# Altium schematic sheet FPGA_52_Keyboard.SchDoc
size B; Organization: Altium Limited; Address1: L3, 12a Rodborough Rd; Address2: Frenchs Forest; Address3: NSW; Address4: Australia 2086; DocumentNumber: 1; SheetNumber: 1; SheetTotal: 1
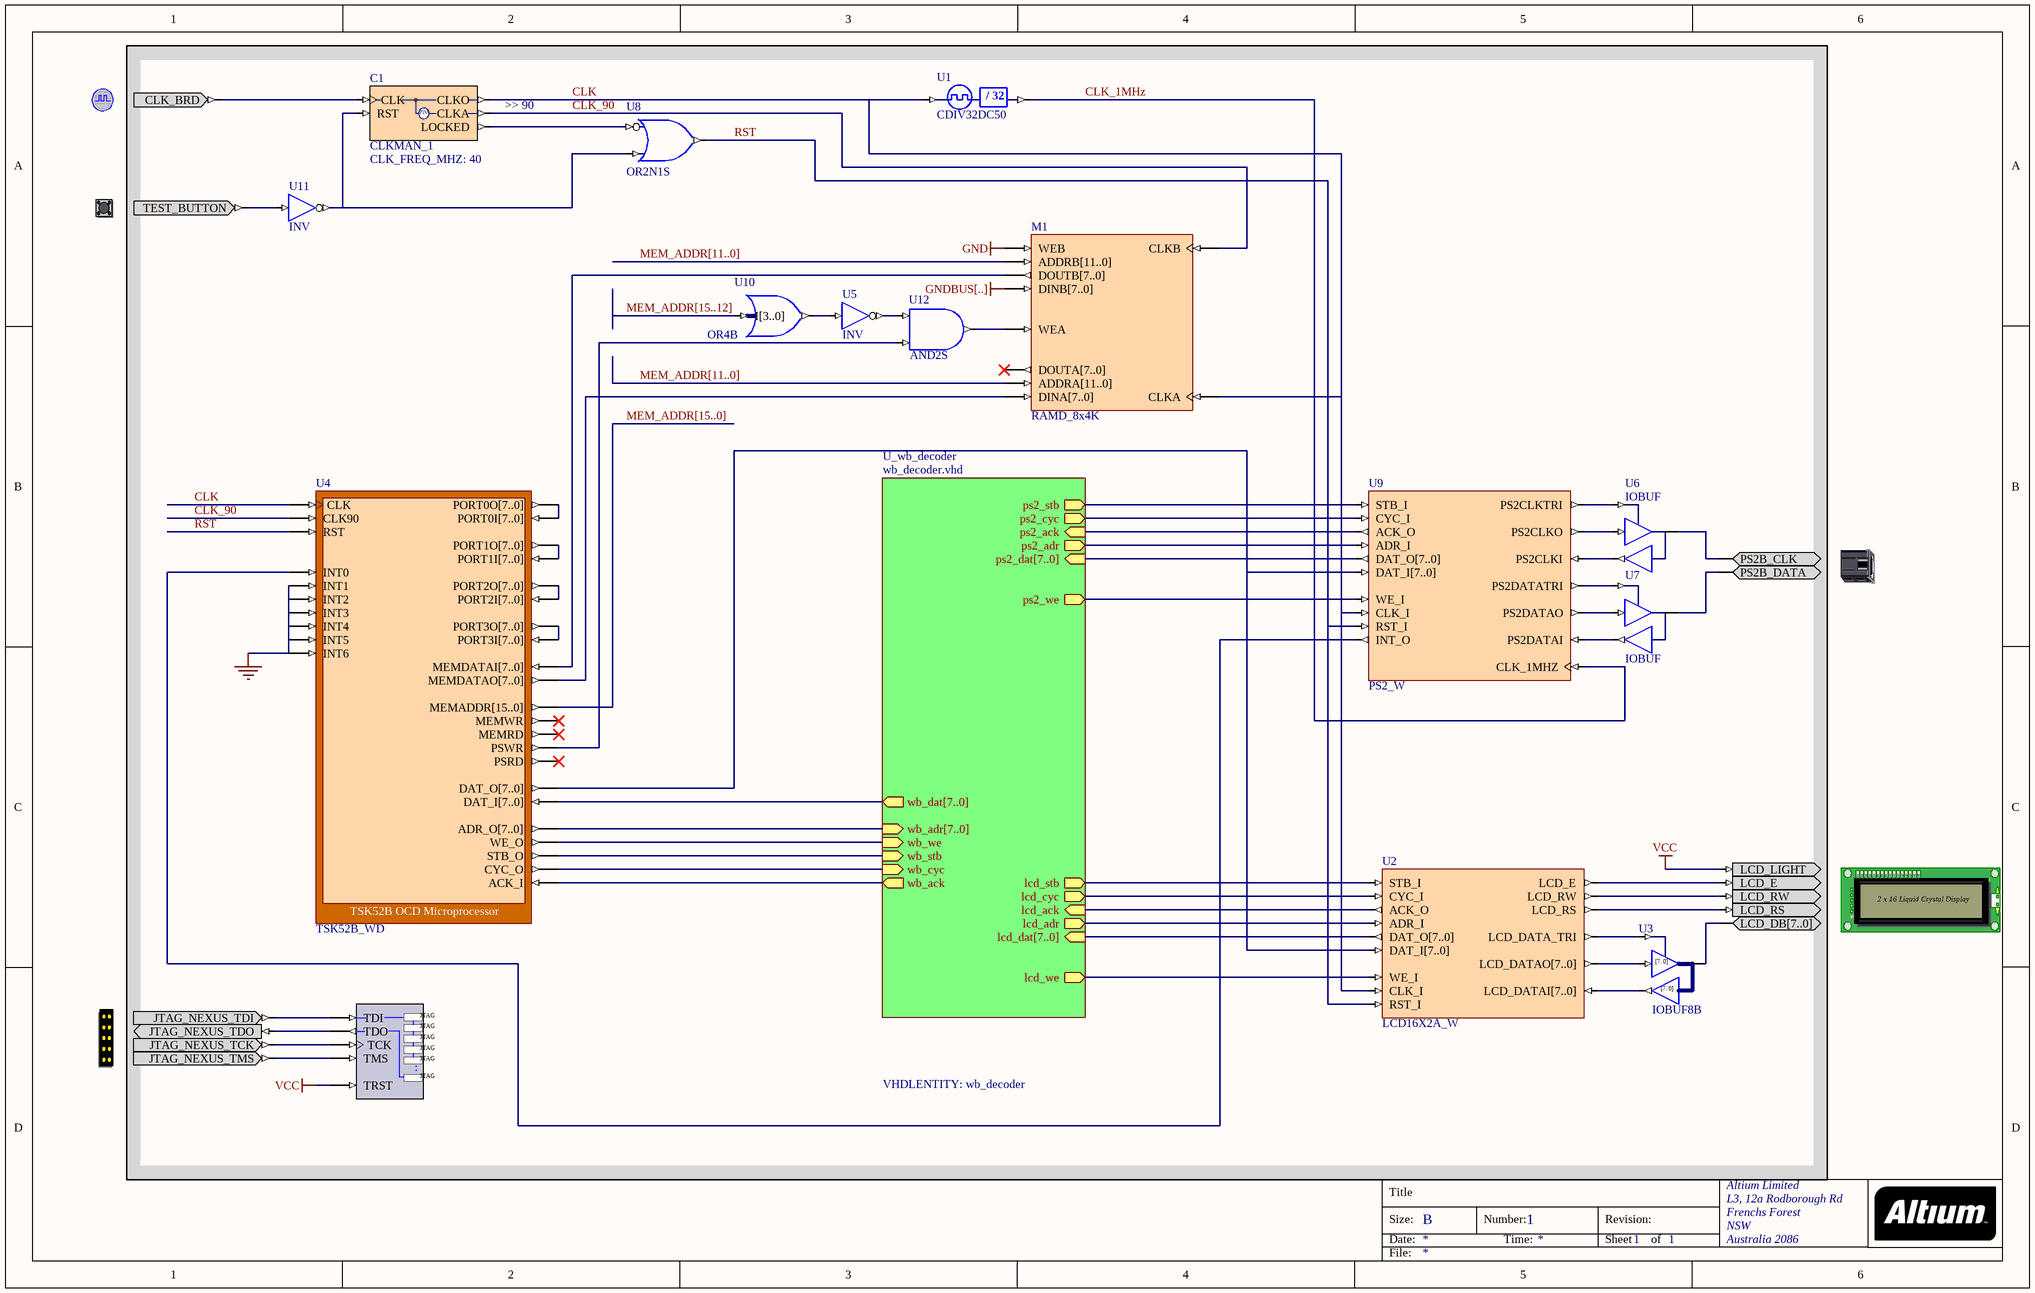
[diagram p0: FPGA_52_Keyboard.SchDoc]

## Parts
(Parts that share a designator on the sheet are numbered #1, #2 ... from top to bottom, then left to right.)
?#1  CLOCK_BOARD  (value not drawn)
?#2  TEST_BUTTON  (value not drawn)
?#3  PS2B  (value not drawn)
?#4  LCD  (value not drawn)
?#5  NEXUS_JTAG_CONNECTOR  (value not drawn)
C1  CLKMAN_1  CLK_FREQ_MHZ: 40  ClkA_Operation: >> 90
M1  RAMD_8x4K
NEXUS_JTAG_PORT  NEXUS_JTAG_PORT  (value not drawn)
U1  CDIV32DC50
U2  LCD16X2A_W
U3  IOBUF8B
U4  TSK52B_WD
U5  INV
U6  IOBUF
U7  IOBUF
U8  OR2N1S
U9  PS2_W
U10  OR4B
U11  INV
U12  AND2S

## Sub-sheets
U_wb_decoder = wb_decoder.vhd: lcd_ack (in), lcd_adr (out), lcd_cyc (out), lcd_dat[7..0] (in), lcd_stb (out), lcd_we (out), wb_ack (out), wb_adr[7..0] (in), wb_cyc (in), wb_dat[7..0] (out), wb_stb (in), wb_we (in), ps2_ack (in), ps2_dat[7..0] (in), ps2_we (out), ps2_stb (out), ps2_cyc (out), ps2_adr (out)  | VHDLENTITY: wb_decoder

## Nets
GND: M1.WEB U4.INT1 U4.INT2 U4.INT3 U4.INT4 U4.INT5 U4.INT6
GNDBUS[..]: M1.DINB[7..0]
VCC: ?#4.LCD_LIGHT NEXUS_JTAG_PORT.TRST
CLK: C1.CLKO M1.CLKA U1.CLKIN U2.CLK_I U4.CLK U9.CLK_I
CLK_1MHz: U1.CLKDV U9.CLK_1MHZ
CLK_90: C1.CLKA M1.CLKB U4.CLK90
MEM_ADDR[11..0]: M1.ADDRA[11..0] M1.ADDRB[11..0]
MEM_ADDR[15..0]: U4.MEMADDR[15..0]
MEM_ADDR[15..12]: U10.I[3..0]
RST: U2.RST_I U4.RST U8.O U9.RST_I
Net?#1_CLK_BRD: ?#1.CLK_BRD C1.CLK
Net?#2_TEST_BUTTON: ?#2.TEST_BUTTON U11.I
Net?#3_PS2B_CLK: ?#3.PS2B_CLK U6.IO
Net?#3_PS2B_DATA: ?#3.PS2B_DATA U7.IO
Net?#4_LCD_DB[7..0]: ?#4.LCD_DB[7..0] U3.IO[7..0]
Net?#4_LCD_E: ?#4.LCD_E U2.LCD_E
Net?#4_LCD_RS: ?#4.LCD_RS U2.LCD_RS
Net?#4_LCD_RW: ?#4.LCD_RW U2.LCD_RW
Net?#5_JTAG_NEXUS_TCK: ?#5.JTAG_NEXUS_TCK NEXUS_JTAG_PORT.TCK
Net?#5_JTAG_NEXUS_TDI: ?#5.JTAG_NEXUS_TDI NEXUS_JTAG_PORT.TDI
Net?#5_JTAG_NEXUS_TDO: ?#5.JTAG_NEXUS_TDO NEXUS_JTAG_PORT.TDO
Net?#5_JTAG_NEXUS_TMS: ?#5.JTAG_NEXUS_TMS NEXUS_JTAG_PORT.TMS
NetC1_LOCKED: C1.LOCKED U8.I0
NetC1_RST: C1.RST U8.I1 U11.O
NetM1_DINA[7..0]: M1.DINA[7..0] U4.MEMDATAO[7..0]
NetM1_DOUTB[7..0]: M1.DOUTB[7..0] U4.MEMDATAI[7..0]
NetM1_WEA: M1.WEA U12.O
NetU2_ACK_O: U2.ACK_O ; sheet U_wb_decoder/lcd_ack
NetU2_ADR_I: U2.ADR_I ; sheet U_wb_decoder/lcd_adr
NetU2_CYC_I: U2.CYC_I ; sheet U_wb_decoder/lcd_cyc
NetU2_DAT_I[7..0]: U2.DAT_I[7..0] U4.DAT_O[7..0] U9.DAT_I[7..0]
NetU2_DAT_O[7..0]: U2.DAT_O[7..0] ; sheet U_wb_decoder/lcd_dat[7..0]
NetU2_LCD_DATA_TRI: U2.LCD_DATA_TRI U3.T
NetU2_LCD_DATAI[7..0]: U2.LCD_DATAI[7..0] U3.O[7..0]
NetU2_LCD_DATAO[7..0]: U2.LCD_DATAO[7..0] U3.I[7..0]
NetU2_STB_I: U2.STB_I ; sheet U_wb_decoder/lcd_stb
NetU2_WE_I: U2.WE_I ; sheet U_wb_decoder/lcd_we
NetU4_ACK_I: U4.ACK_I ; sheet U_wb_decoder/wb_ack
NetU4_ADR_O[7..0]: U4.ADR_O[7..0] ; sheet U_wb_decoder/wb_adr[7..0]
NetU4_CYC_O: U4.CYC_O ; sheet U_wb_decoder/wb_cyc
NetU4_DAT_I[7..0]: U4.DAT_I[7..0] ; sheet U_wb_decoder/wb_dat[7..0]
NetU4_INT0: U4.INT0 U9.INT_O
NetU4_PORT0I[7..0]: U4.PORT0I[7..0] U4.PORT0O[7..0]
NetU4_PORT1I[7..0]: U4.PORT1I[7..0] U4.PORT1O[7..0]
NetU4_PORT2I[7..0]: U4.PORT2I[7..0] U4.PORT2O[7..0]
NetU4_PORT3I[7..0]: U4.PORT3I[7..0] U4.PORT3O[7..0]
NetU4_PSWR: U4.PSWR U12.I1
NetU4_STB_O: U4.STB_O ; sheet U_wb_decoder/wb_stb
NetU4_WE_O: U4.WE_O ; sheet U_wb_decoder/wb_we
NetU5_I: U5.I U10.O
NetU5_O: U5.O U12.I0
NetU6_I: U6.I U9.PS2CLKO
NetU6_O: U6.O U9.PS2CLKI
NetU6_T: U6.T U9.PS2CLKTRI
NetU7_I: U7.I U9.PS2DATAO
NetU7_O: U7.O U9.PS2DATAI
NetU7_T: U7.T U9.PS2DATATRI
NetU9_ACK_O: U9.ACK_O ; sheet U_wb_decoder/ps2_ack
NetU9_ADR_I: U9.ADR_I ; sheet U_wb_decoder/ps2_adr
NetU9_CYC_I: U9.CYC_I ; sheet U_wb_decoder/ps2_cyc
NetU9_DAT_O[7..0]: U9.DAT_O[7..0] ; sheet U_wb_decoder/ps2_dat[7..0]
NetU9_STB_I: U9.STB_I ; sheet U_wb_decoder/ps2_stb
NetU9_WE_I: U9.WE_I ; sheet U_wb_decoder/ps2_we

Not connected (* = marked no-connect by the designer): M1 DOUTA[7..0]*; U4 MEMRD* MEMWR* PSRD*

## Buses and harness runs
bus MEM_ADDR[11..0]
bus MEM_ADDR[15..0]
bus MEM_ADDR[15..12]

## Notes on the sheet
- Title
- Size:
- Date:
- B
- Number:
- Time:
- Revision:
- Sheet
- of
- File:
- (in symbol CDIV32DC50) / 32
- (in symbol CLKMAN_1) F(x)
- (in symbol IOBUF8B) [7..0]
- (in symbol LCD) 2 x 16 Liquid Crystal Display
- (in symbol NEXUS_JTAG_PORT) JTAG; .

## Library data of the parts
?#1 = CLOCK_BOARD: Global System Clock Supply; PortComponent: True; Published: 19-Nov-2003; Publisher: Altium Limited
?#2 = TEST_BUTTON: Test Button; PortComponent: True; Published: 19-Nov-2003; Publisher: Altium Limited
?#3 = PS2B: Key Board PS2 Connector; PortComponent: True; Published: 19-Nov-2003; Publisher: Altium Limited
?#4 = LCD: Liquid Crystal Display; PortComponent: True; Published: 19-Nov-2003; Publisher: Altium Limited
?#5 = NEXUS_JTAG_CONNECTOR: JTAG Port; PortComponent: True; Published: 19-Nov-2003; Publisher: Altium Limited
C1 = CLKMAN_1: Single Operational Output Clock Manager; Clk_Count: 1; Published: 5-Jul-2004; Publisher: Altium Limited; Core Revision: 1.00.00; Nexus_Core: ClockManager; HelpURL: CR0118 FPGA Generic Library Guide.pdf#page=148; Functional Class: Clock Manager; Port Size: 1
M1 = RAMD_8x4K: Dual Port Random Access Memory; Memory_DepthA: 4096; Memory_Type: RAM_DualPortBlock; Memory_WidthA: 8; Memory_ClockEdge: Rising; Nexus_Core: Memory_Program; Published: 13/01/2004; Publisher: Altium Hobart Technology Center; Memory_DepthB: 4096; Memory_WidthB: 8
NEXUS_JTAG_PORT = NEXUS_JTAG_PORT: Soft Nexus-Chain Connector; NEXUS_JTAG_CONNECTOR: True; Published: 18-Dec-2003; Publisher: Altium Limited
U1 = CDIV32DC50: Clock Divider by 32 with 50% Duty Cycle Output; ArchiveName: GENERIC; VHDLIB_SIM: GENERIC_LIB; Published: 29-Jan-2004; Publisher: Altium Limited; Core Revision: 1.00.00
U2 = LCD16X2A_W: LCD Controller Wishbone; Published: 9-Dec-2004; Publisher: Altium Limited; ComponentLink1Description: Core &Resource Usage; ComponentLink1URL: CR0139 FPGA Peripheral Resource Usage.pdf#page=17; HelpURL: CR0107 LCD16X2 LCD Controller.pdf#page=2; LastRevisionNo: 1.00.00
U3 = IOBUF8B: 8-Bit Input/Output Buffer, Bus Version; ArchiveName: GENERIC; Published: 18-Dec-2003; Publisher: Altium Limited; Core Revision: 1.00.00
U4 = TSK52B_WD: TSK52B OCD Microprocessor; NEXUS_CORE: Processor_OCDS; NEXUS_JTAG_DEVICE: True; NEXUS_JTAG_ORDER: 0; ChildModel1: TSK52B_WD_DRAM8X256; ChildCore1: M1; Memory_Configuration: Record[NEXUS_CORE]{}ComponentDesignator[iram]{}Memory_Depth[256]{}Memory_UsageType[ram]{}ProgramDownloadAddress[0x0]{}Memory_BusType[c51:idata_bus]{n}Record[NEXUS_CORE]{}ComponentDesignator[xram]{}Memory_Depth[64k]{}Memory_UsageType[ram]{}ProgramDownloadAddress[0x0]{}Memory_BusType[c51:xdata_bus]{n}Record[NEXUS_CORE]{}ComponentDesignator[xrom]{}Memory_Depth[64k]{}Memory_UsageType[rom]{}ProgramDownloadAddress[0x0]{}Memory_BusType[c51:code_bus]{n}; Published: 5/07/2004; Publisher: Altium Hobart Technology Centre; Core Revision: 1.00.00
U5 U11 = INV: Inverter; ArchiveName: GENERIC; VHDLIB_SIM: GENERIC_LIB; Published: 29-Jan-2004; Publisher: Altium Limited; Xilinx Equivalent: INV; Core Revision: 1.00.00
U6 U7 = IOBUF: Input/Output Buffer; ArchiveName: GENERIC; Published: 18-Nov-2003; Publisher: Altium Limited; Xilinx Equivalent: IOBUF; Core Revision: 1.00.00
U8 = OR2N1S: 2-Input OR Gate with Active Low A Input, Single Pin Version; Xilinx Equivalent: OR2B1; ArchiveName: GENERIC; VHDLIB_SIM: GENERIC_LIB; Published: 29-Jan-2004; Publisher: Altium Limited; Core Revision: 1.00.00
U9 = PS2_W: PS2 Controller Wishbone; Published: 9-Dec-2004; Publisher: Altium Limited; ComponentLink1Description: Core &Resource Usage; ComponentLink1URL: CR0139 FPGA Peripheral Resource Usage.pdf#page=38; HelpURL: CR0109 PS2 Controller.pdf#page=2; LastRevisionNo: 1.00.00
U10 = OR4B: 4-Input OR Gate, Bus Version; ArchiveName: GENERIC; VHDLIB_SIM: GENERIC_LIB; Published: 29-Jan-2004; Publisher: Altium Limited; Core Revision: 1.00.00
U12 = AND2S: 2-Input AND Gate, Single Pin Version; Xilinx Equivalent: AND2; ArchiveName: GENERIC; VHDLIB_SIM: GENERIC_LIB; Published: 29-Jan-2004; Publisher: Altium Limited; Core Revision: 1.00.00